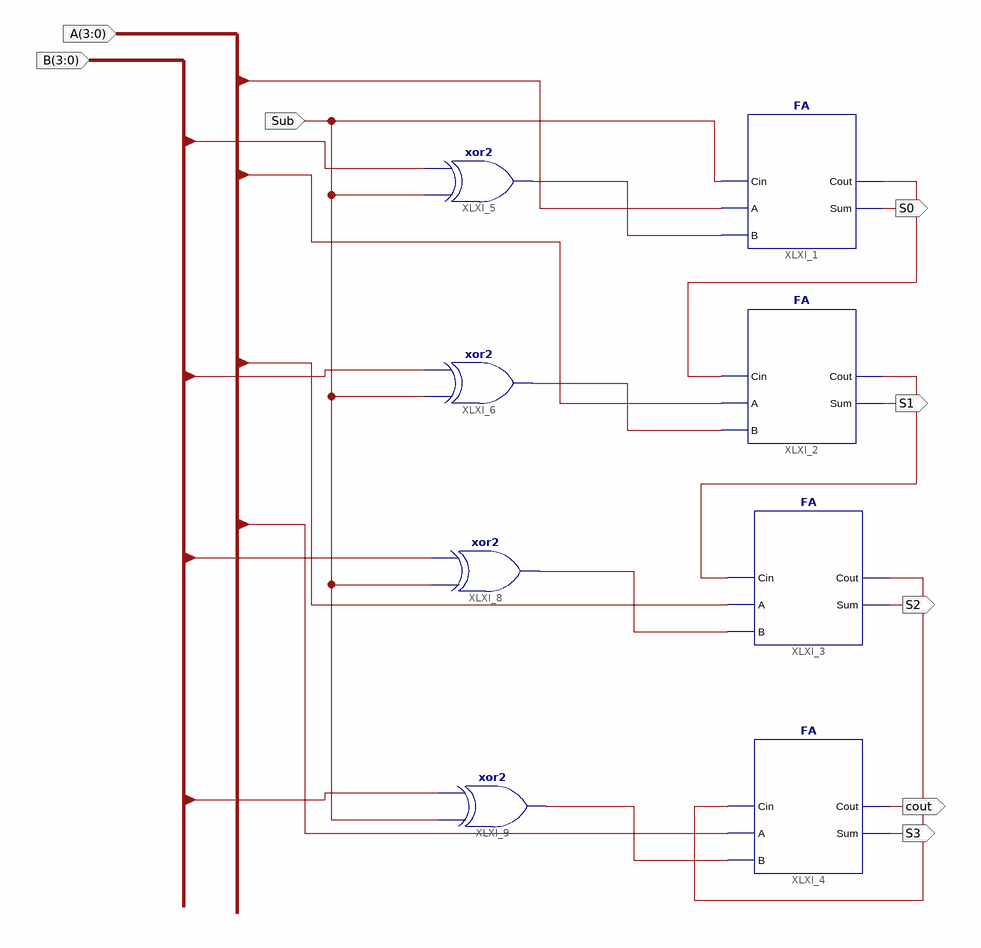
[diagram p0: schematic sheet 1]
// Xilinx ISE schematic ex2.sch (spartan3e) as structural Verilog: 8 symbols, 8 ports
module ex2 (
  input  Sub,
  input  [3:0] A,
  input  [3:0] B,
  output S0,
  output S1,
  output S2,
  output cout,
  output S3
);

  wire XLXN_1, XLXN_2, XLXN_3, XLXN_4, XLXN_10, XLXN_11, XLXN_12;

  FA XLXI_1 (.Cin(Sub), .Cout(XLXN_10), .A(A[0]), .B(XLXN_1), .Sum(S0));
  FA XLXI_2 (.Cin(XLXN_10), .Cout(XLXN_11), .A(A[1]), .B(XLXN_2), .Sum(S1));
  FA XLXI_3 (.Cin(XLXN_11), .Cout(XLXN_12), .A(A[2]), .B(XLXN_3), .Sum(S2));
  FA XLXI_4 (.Cin(XLXN_12), .Cout(cout), .A(A[3]), .B(XLXN_4), .Sum(S3));
  xor XLXI_5 (XLXN_1, Sub, B[0]);
  xor XLXI_6 (XLXN_2, Sub, B[1]);
  xor XLXI_8 (XLXN_3, Sub, B[2]);
  xor XLXI_9 (XLXN_4, Sub, B[3]);
endmodule
